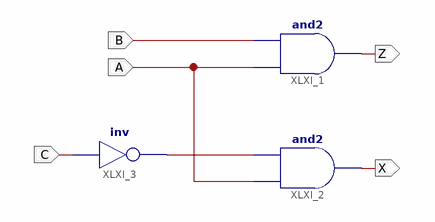
[diagram p0: schematic sheet 1]
// Xilinx ISE schematic compuertas.sch (spartan3e) as structural Verilog: 3 symbols, 5 ports
module compuertas (
  input  B,
  input  A,
  input  C,
  output Z,
  output X
);

  wire XLXN_6;

  and XLXI_1 (Z, A, B);
  and XLXI_2 (X, A, XLXN_6);
  not XLXI_3 (XLXN_6, C);
endmodule
